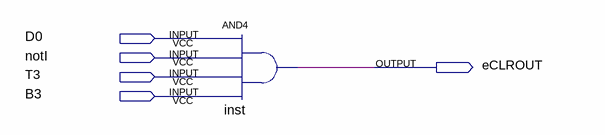
[diagram p0: schematic sheet]
// Quartus schematic eCLR.bdf as structural Verilog: 1 symbols, 5 pins
module eCLR (
  input  D0,
  input  notI,
  input  T3,
  input  B3,
  output eCLROUT
);

  and inst (eCLROUT, D0, notI, T3, B3);
endmodule
